# EAGLE design 3phasecntrl-rev2-1 (EAGLE 9.6.2)
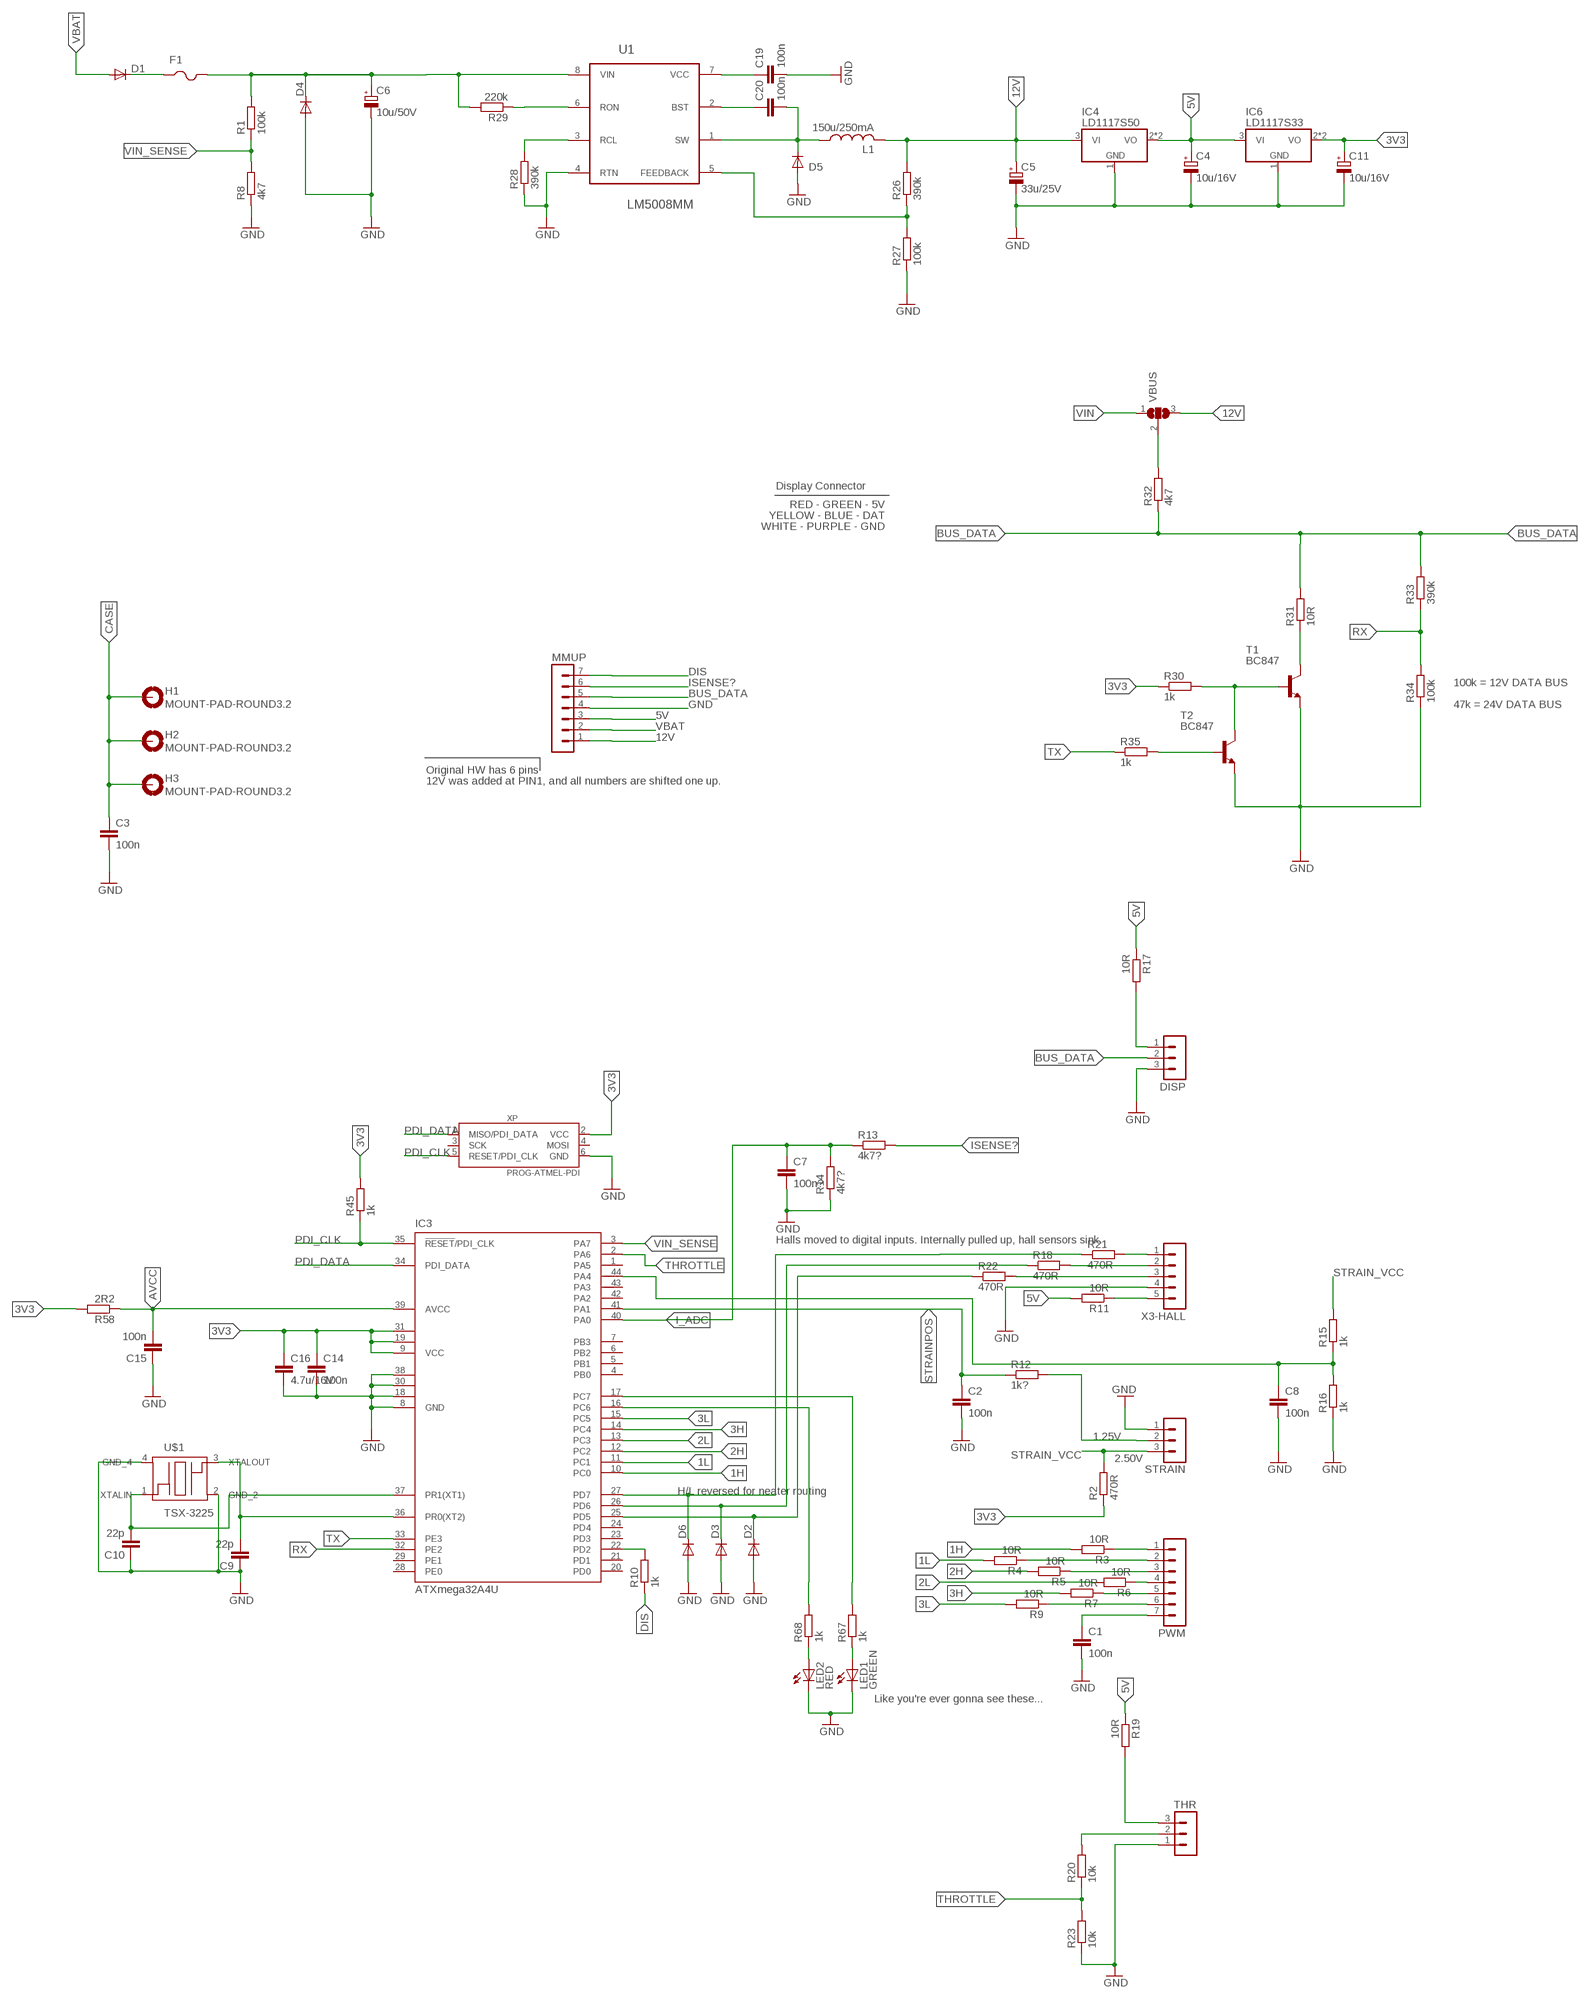
[diagram p0: schematic, sheet 1]

## Parts
C1  100n  C-EUC0805K  [C0805K]
C2  100n  C-EUC0805K  [C0805K]
C3  100n  C-EUC0805K  [C0805K]
C4  10u/16V  CPOL-EU153CLV-0405  [153CLV-0405]
C5  33u/25V  CPOL-EU153CLV-0605  [153CLV-0605]
C6  10u/50V  CPOL-EU153CLV-0605  [153CLV-0605]
C7  100n?  C-EUC0805K  [C0805K]
C8  100n  C-EUC0805K  [C0805K]
C9  22p  C-EUC0805K  [C0805K]
C10  22p  C-EUC0805K  [C0805K]
C11  10u/16V  CPOL-EU153CLV-0405  [153CLV-0405]
C14  100n  C-EUC0805K  [C0805K]
C15  100n  C-EUC0805K  [C0805K]
C16  4.7u/16V  C-EUC0805K  [C0805K]
C19  100n  C-EUC0805K  [C0805K]
C20  100n  C-EUC0805K  [C0805K]
D1  BAT46WH  DIODE-SMB  [SMB]
D2  PTVS3V3S1UTR  DIODE-SOD123  [SOD123]
D3  PTVS3V3S1UTR  DIODE-SOD123  [SOD123]
D4  SM6T39A  DIODE-SMB  [SMB]
D5  BAT46WH  DIODE-SOD323-W  [SOD323-W]
D6  PTVS3V3S1UTR  DIODE-SOD123  [SOD123]
DISP  MA03-1  [MA03-1]
F1  PTCFUSE-1812  [1812]
H1  MOUNT-PAD-ROUND3.2  [3,2-PAD]
H2  MOUNT-PAD-ROUND3.2  [3,2-PAD]
H3  MOUNT-PAD-ROUND3.2  [3,2-PAD]
IC3  ATXmega32A4U  XMEGA16A4A  [TQFP44]
IC4  LD1117S50  LM340ST-ST  [SOT223]
IC6  LD1117S33  LM340ST-ST  [SOT223]
L1  150u/250mA  L-USWE-TPC  [POWER-CHOKE_WE-TPC]
LED1  GREEN  LEDCHIPLED_0805  [CHIPLED_0805]
LED2  RED  LEDCHIPLED_0805  [CHIPLED_0805]
MMUP  MA07-1  [MA07-1]
PWM  MA07-1  [MA07-1]
R1  100k  R-EU_M0805  [M0805]
R2  470R  R-EU_M0805  [M0805]
R3  10R  R-EU_M0805  [M0805]
R4  10R  R-EU_M0805  [M0805]
R5  10R  R-EU_M0805  [M0805]
R6  10R  R-EU_M0805  [M0805]
R7  10R  R-EU_M0805  [M0805]
R8  4k7  R-EU_M0805  [M0805]
R9  10R  R-EU_M0805  [M0805]
R10  1k  R-EU_M0805  [M0805]
R11  10R  R-EU_M0805  [M0805]
R12  1k?  R-EU_M0805  [M0805]
R13  4k7?  R-EU_M0805  [M0805]
R14  4k7?  R-EU_M0805  [M0805]
R15  1k  R-EU_M0805  [M0805]
R16  1k  R-EU_M0805  [M0805]
R17  10R  R-EU_M0805  [M0805]
R18  470R  R-EU_M0805  [M0805]
R19  10R  R-EU_M0805  [M0805]
R20  10k  R-EU_M0805  [M0805]
R21  470R  R-EU_M0805  [M0805]
R22  470R  R-EU_M0805  [M0805]
R23  10k  R-EU_M0805  [M0805]
R26  390k  R-EU_M0805  [M0805]
R27  100k  R-EU_M0805  [M0805]
R28  390k  R-EU_M0805  [M0805]
R29  220k  R-EU_M0805  [M0805]
R30  1k  R-EU_M0805  [M0805]
R31  10R  R-EU_M0805  [M0805]
R32  4k7  R-EU_M0805  [M0805]
R33  390k  R-EU_M0805  [M0805]
R34  100k  R-EU_M0805  [M0805]
R35  1k  R-EU_M0805  [M0805]
R45  1k  R-EU_R0805  [R0805]
R58  2R2  R-EU_R0805  [R0805]
R67  1k  R-EU_M0805  [M0805]
R68  1k  R-EU_M0805  [M0805]
STRAIN  MA03-1  [MA03-1]
T1  BC847  [SOT23]
T2  BC847  [SOT23]
THR  MA03-1  [MA03-1]
U1  LM5008MM  [SOP65P490X109-8N]
U$1  TSX-3225  [TSX-3225]
VBUS  SJ2W  [SJ_2]
X3-HALL  MA05-1  [MA05-1]
XP  PROG-ATMEL-PDI  [6-LSTB2]

## Nets
1H: IC3.10(PC0) R3.2
1L: IC3.11(PC1) R4.2
2H: IC3.12(PC2) R5.2
2L: IC3.13(PC3) R6.2
3H: IC3.14(PC4) R7.2
3L: IC3.15(PC5) R9.2
3V3: C11.+ C14.1 C16.1 IC3.9(VCC) IC3.19(VCC1) IC3.31(VCC2) IC6.2(VO) IC6.4(VO) R2.1 R30.1 R45.2 R58.2 XP.2(VCC)
5V: C4.+ IC4.2(VO) IC4.4(VO) IC6.3(VI) MMUP.3 R11.2 R17.1 R19.1
12V: C5.+ IC4.3(VI) L1.2 MMUP.1 R26.2 VBUS.3
AVCC: C15.2 IC3.39(AVCC) R58.1
BUS_DATA: DISP.2 MMUP.5 R31.2 R32.1 R33.2
CASE: C3.1 H1.B3,2(MOUNT) H2.B3,2(MOUNT) H3.B3,2(MOUNT)
DIS: MMUP.7 R10.1
GND: C1.2 C2.2 C3.2 C4.- C5.- C6.- C7.2 C8.2 C9.1 C10.1 C11.- C14.2 C15.1 C16.2 C19.2 D2.A D3.A D4.A D5.A D6.A DISP.3 IC3.8(GND) IC3.18(GND1) IC3.30(GND2) IC3.38(GND3) IC4.1(GND) IC6.1(GND) LED1.C LED2.C MMUP.4 R8.1 R14.1 R16.1 R23.1 R27.1 R28.1 R34.1 STRAIN.1 T1.2(E) T2.2(E) THR.1 U1.4(RTN) U$1.2(GND_2) U$1.4(GND_4) X3-HALL.4 XP.6(GND)
I_ADC: C7.1 IC3.40(PA0) R13.1 R14.2
ISENSE?: MMUP.6 R13.2
N$1: C1.1 PWM.7
N$2: D1.C F1.1
N$3: C19.1 U1.7(VCC)
N$4: PWM.1 R3.1
N$5: R12.2 STRAIN.2
N$6: R32.2 VBUS.2
N$7: IC3.22(PD2) R10.2
N$8: R11.1 X3-HALL.5
N$9: R21.2 X3-HALL.1
N$10: PWM.2 R4.1
N$11: R18.2 X3-HALL.2
N$12: R31.1 T1.3(C)
N$13: R22.2 X3-HALL.3
N$14: C10.2 IC3.37(PR1(XT1)) U$1.1(XTALIN)
N$15: LED1.A R67.1
N$16: LED2.A R68.1
N$17: C20.1 U1.2(BST)
N$18: R19.2 THR.3
N$19: D6.C IC3.27(PD7) R21.1
N$20: IC3.16(PC6) R68.2
N$21: IC3.17(PC7) R67.2
N$22: C20.2 D5.C L1.1 U1.1(SW)
N$23: R35.2 T2.1(B)
N$24: R26.1 R27.2 U1.5(FEEDBACK)
N$25: R30.2 T1.1(B) T2.3(C)
N$26: D3.C IC3.26(PD6) R18.1
N$27: R28.2 U1.3(RCL)
N$28: PWM.3 R5.1
N$29: PWM.4 R6.1
N$30: R29.1 U1.6(RON)
N$31: D2.C IC3.25(PD5) R22.1
N$33: PWM.5 R7.1
N$34: PWM.6 R9.1
N$35: DISP.1 R17.2
N$44: C9.2 IC3.36(PR0(XT2)) U$1.3(XTALOUT)
PDI_CLK: IC3.35(!RESET!/PDI_CLK) R45.1 XP.5(RESET/PDI_CLK)
PDI_DATA: IC3.34(PDI_DATA) XP.1(MISO/PDI_DATA)
RX: IC3.32(PE2) R33.1 R34.2
STRAIN_VCC: R2.2 R15.2 STRAIN.3
STRAINPOS: C2.1 IC3.41(PA1) R12.1
STRAINREF: C8.1 IC3.44(PA4) R15.1 R16.2
THIN: R20.2 THR.2
THROTTLE: IC3.2(PA6) R20.1 R23.2
TX: IC3.33(PE3) R35.1
VBAT: D1.A MMUP.2
VIN: C6.+ D4.C F1.2 R1.2 R29.2 U1.8(VIN) VBUS.1
VIN_SENSE: IC3.3(PA7) R1.1 R8.2
Unconnected: IC3.1(PA5) IC3.4(PB0) IC3.5(PB1) IC3.6(PB2) IC3.7(PB3) IC3.20(PD0) IC3.21(PD1) IC3.23(PD3) IC3.24(PD4) IC3.28(PE0) IC3.29(PE1) IC3.42(PA2) IC3.43(PA3) XP.3(SCK) XP.4(MOSI)

## Notes on the sheet
- Display Connector
- RED - GREEN - 5V
- YELLOW - BLUE - DAT
- WHITE - PURPLE - GND
- 100k = 12V DATA BUS
- 47k = 24V DATA BUS
- Original HW has 6 pins
- 12V was added at PIN1, and all numbers are shifted one up.
- Halls moved to digital inputs. Internally pulled up, hall sensors sink.
- 1.25V
- 2.50V
- H/L reversed for neater routing
- Like you're ever gonna see these...

## Library data of the parts
C1-C3 C7-C10 C14-C16 C19 C20 = rcl:C-EU: CAPACITOR, European symbol
C4-C6 C11 = rcl:CPOL-EU: POLARIZED CAPACITOR, European symbol
D1 = diode:DIODE-: DIODE; FARNELL: 2069340
D2 D3 D6 = diode:DIODE-: DIODE; FARNELL: 2575110
D4 = diode:DIODE-: DIODE; FARNELL: 9802703
D5 = diode:DIODE-: DIODE
DISP STRAIN THR = con-lstb:MA03-1: PIN HEADER; OC_FARNELL: unknown; OC_NEWARK: unknown
F1 = adafruit:PTCFUSE: PTC fuses, resettable thermistors
H1-H3 = holes:MOUNT-PAD-ROUND: MOUNTING PAD, round
IC3 = atmel:XMEGA16A4: MICROCONTROLLER Features High-performance, Low-power 8/16-bit AVR XMEGA Microcontroller Non-Volatile Program and Data Memories - 16 KB - 128 KB of In-System Self-Programmable Flash - 4 KB - 8 KB Boot Code Section with Independent Lock Bits - 1 KB - 2 KB EEPROM - 2 KB - 8 KB Internal SRAM Peripheral Features - Four-channel DMA Controller with support for external requests - Eight-channel Event System - Five 16-bit Timer/Counters Three Timer/Counters with 4 Output Compare or Input Capture channels Two Timer/Counters with 2 Output Compare or Input Capture channels High-Resolution Extensions on all Timer/Counters Advanced Waveform Extension on one Timer/Counter - Five USARTs IrDA Extension on one USART - Two Two-Wire Interfaces with dual address match (I2C and SMBus compatible) - Two SPIs (Serial Peripheral Interfaces) peripherals - AES and DES Crypto Engine - 16-bit Real Time Counter with Separate Oscillator - One Twelve-channel, 12-bit, 2 Msps Analog to Digital Converter - One Two-channel, 12-bit, 1 Msps Digital to Analog Converter - Two Analog Comparators with Window compare function - External Interrupts on all General Purpose I/O pins - Programmable Watchdog Timer with Separate On-chip Ultra Low Power Oscillator Special Microcontroller Features - Power-on Reset and Programmable Brown-out Detection - Internal and External Clock Options with PLL - Programmable Multi-level Interrupt Controller - Sleep Modes: Idle, Power-down, Standby, Power-save, Extended Standby - Advanced Programming, Test and Debugging Interfaces PDI (Program and Debug Interface) for programming, test and debugging I/O and Packages - 34 Programmable I/O Lines - 44 - lead TQFP - 44 - pad VQFN/QFN - 49 - ball VFBGA Operating Voltage - 1.6 - 3.6V Speed performance - 0 - 12 MHz @ 1.6 - 3.6V - 0 - 32 MHz @ 2.7 - 3.6V Drawn by Dipl.-Ing. (FH) Robert Siegler Created: 27.05.09; OC_FARNELL: unknown; OC_NEWARK: unknown
IC4 = linear:LM340?-*: Positive VOLTAGE REGULATOR Source: http://cache.national.com/ds/LM/LM340.pdf; FARNELL: 1467780
IC6 = linear:LM340?-*: Positive VOLTAGE REGULATOR Source: http://cache.national.com/ds/LM/LM340.pdf
L1 = rcl:L-US: INDUCTOR, American symbol
LED1 LED2 = led:LED: LED OSRAM: - CHIPLED LG R971, LG N971, LY N971, LG Q971, LY Q971, LO R971, LY R971 LH N974, LH R974 LS Q976, LO Q976, LY Q976 LO Q996 - Hyper CHIPLED LW Q18S LB Q993, LB Q99A, LB R99A - SideLED LS A670, LO A670, LY A670, LG A670, LP A670 LB A673, LV A673, LT A673, LW A673 LH A674 LY A675 LS A676, LA A676, LO A676, LY A676, LW A676 LS A679, LY A679, LG A679 - Hyper Micro SIDELED® LS Y876, LA Y876, LO Y876, LY Y876 LT Y87S - SmartLED LW L88C, LW L88S LB L89C, LB L89S, LG L890 LS L89K, LO L89K, LY L89K LS L896, LA L896, LO L896, LY L896 - TOPLED LS T670, LO T670, LY T670, LG T670, LP T670 LSG T670, LSP T670, LSY T670, LOP T670, LYG T670 LG T671, LOG T671, LSG T671 LB T673, LV T673, LT T673, LW T673 LH T674 LS T676, LA T676, LO T676, LY T676, LB T676, LH T676, LSB T676, LW T676 LB T67C, LV T67C, LT T67C, LS T67K, LO T67K, LY T67K, LW E67C LS E67B, LA E67B, LO E67B, LY E67B, LB E67C, LV E67C, LT E67C LW T67C LS T679, LY T679, LG T679 LS T770, LO T770, LY T770, LG T770, LP T770 LB T773, LV T773, LT T773, LW T773 LH T774 LS E675, LA E675, LY E675, LS T675 LS T776, LA T776, LO T776, LY T776, LB T776 LHGB T686 LT T68C, LB T68C - Hyper Mini TOPLED® LB M676 - Mini TOPLED Santana® LG M470 LS M47K, LO M47K, LY M47K Source: http://www.osram.convergy.de LUXEON: - LUMILED® LXK2-PW12-R00, LXK2-PW12-S00, LXK2-PW14-U00, LXK2-PW14-V00 LXK2-PM12-R00, LXK2-PM12-S00, LXK2-PM14-U00 LXK2-PE12-Q00, LXK2-PE12-R00, LXK2-PE12-S00, LXK2-PE14-T00, LXK2-PE14-U00 LXK2-PB12-K00, LXK2-PB12-L00, LXK2-PB12-M00, LXK2-PB14-N00, LXK2-PB14-P00, LXK2-PB14-Q00 LXK2-PR12-L00, LXK2-PR12-M00, LXK2-PR14-Q00, LXK2-PR14-R00 LXK2-PD12-Q00, LXK2-PD12-R00, LXK2-PD12-S00 LXK2-PH12-R00, LXK2-PH12-S00 LXK2-PL12-P00, LXK2-PL12-Q00, LXK2-PL12-R00 Source: www.luxeon.com KINGBRIGHT: KA-3528ASYC Source: www.kingbright.com
MMUP PWM = con-lstb:MA07-1: PIN HEADER; OC_FARNELL: unknown; OC_NEWARK: unknown
R1-R23 R26-R35 R45 R58 R67 R68 = rcl:R-EU_: RESISTOR, European symbol
T1 T2 = transistor:BC847: NPN TRANSISTOR
U1 = components:LM5008MM: Step-Down Switching Regulator; MPN: LM5008MM; OC_FARNELL: 8181721; OC_NEWARK: 38K3760; PACKAGE: SOP-8; SUPPLIER: National Semiconductor
U$1 = crystals:TSX-3225
VBUS = jumper:SJ2W: SMD solder JUMPER
X3-HALL = con-lstb:MA05-1: PIN HEADER; OC_FARNELL: unknown; OC_NEWARK: unknown
XP = components:PROG-ATMEL-PDI

## Board
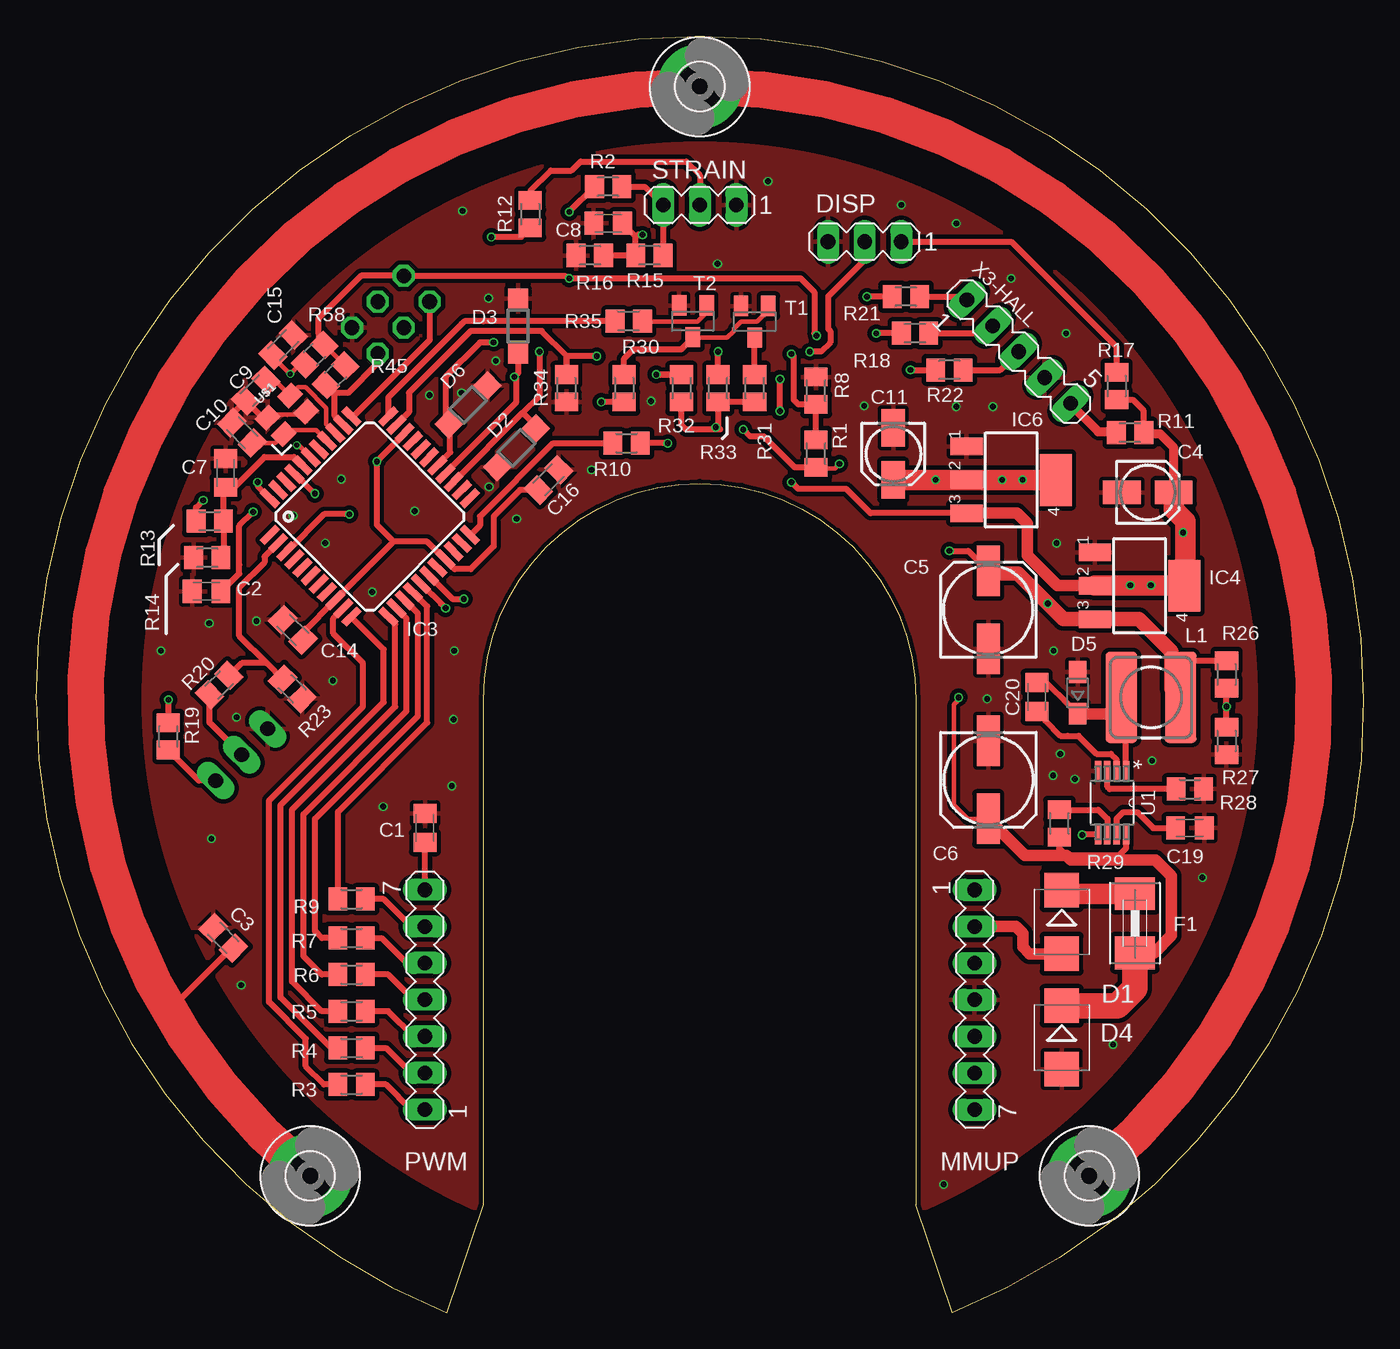
[diagram p1: board, top side]
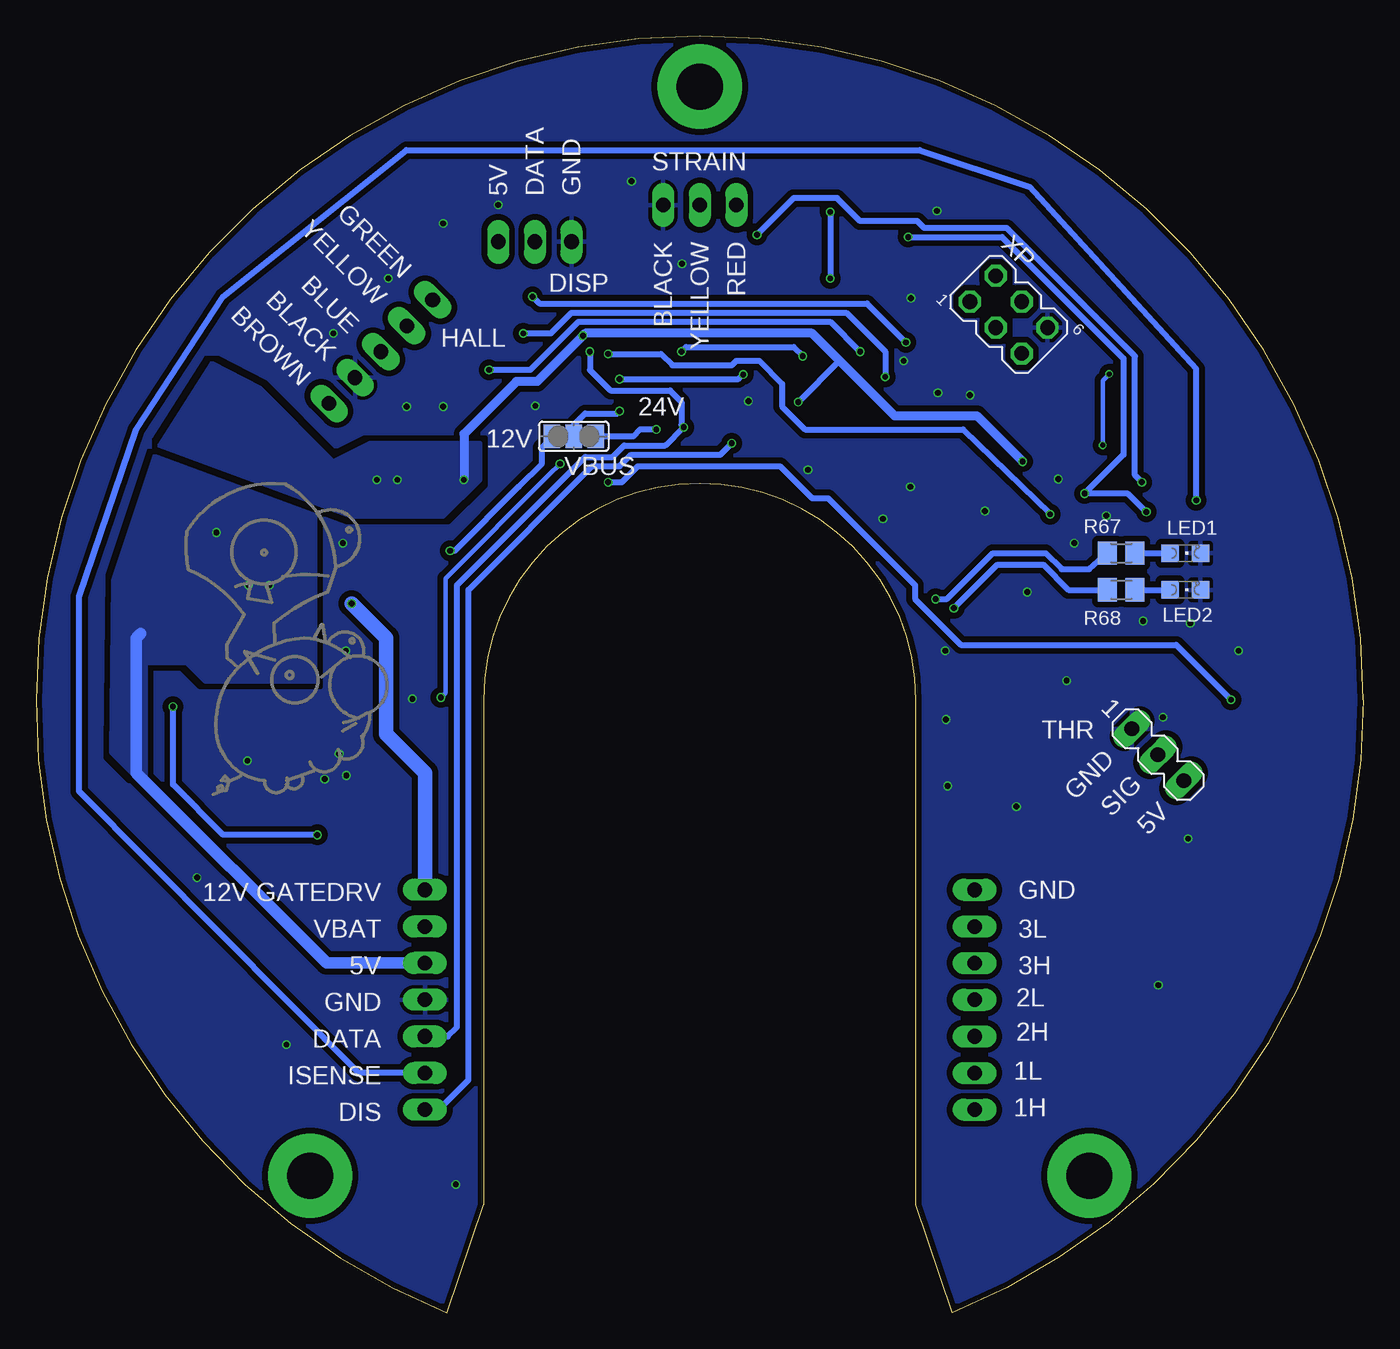
[diagram p2: board, bottom side, seen from below]

Size 92 x 88.5 mm. Coordinates in mm from the lower left corner, seen from the top.
Outline: 0,42.5 arc-90 46,88.5 arc-90 92,42.5 arc-68 63.5,0 61,7.5 61,42.5 arc180 31,42.5 31,7.5 28.5,0 arc-68 0,42.5
Copper layers (1*16): Top 0.035559375mm / dielectric 1.6mm / Bottom 0.035559375mm
Design rules "jlcpcb2layer": minimum track width 5mil, minimum drill 12mil, track to track 5mil, track to pad 5mil, pad to pad 5mil, via to via 5mil, smd to smd 5mil, copper to edge 8mil, drill to drill 6mil, minimum pad ring 5mil, minimum via ring 3mil, stop-mask expansion 2.5mil, vias tented up to drill 0mil, thermal gap 10mil
tRestrict: area 7,3.5 to 85,81.5

### Footprints (pad centres in the part's own frame; a part is rotated, then mirrored left to right if it is on the bottom)
C0805K = smd 1.3 x 1.6: 1 -1,0; 2 1,0
153CLV-0405 = smd 2.6 x 1.6: + 1.8,0; - -1.8,0
153CLV-0605 = smd 3.5 x 1.6: + 2.7,0; - -2.7,0
SMB = smd 2.4 x 2.4: A 2.2,0; C -2.2,0
SOD123 = smd 1.4 x 1.4: A 1.9,0; C -1.9,0
SOD323-W = smd 1.5 x 1.2: A 1.45,0; C -1.45,0
MA03-1 = drill 1.016 long: 1 -2.54,0; 2 0,0; 3 2.54,0
1812 = smd 2.286 x 2.794: 1 -2.046,0; 2 2.046,0
3,2-PAD = drill 3.2 pad 5.842: B3,2 0,0
TQFP44 = smd 1.5 x 0.5: 1 -5.8,4; 2 -5.8,3.2; 3 -5.8,2.4; 4 -5.8,1.6; 5 -5.8,0.8; 6 -5.8,0; 7 -5.8,-0.8; 8 -5.8,-1.6; 9 -5.8,-2.4; 10 -5.8,-3.2; 11 -5.8,-4; 23 5.8,-4; 24 5.8,-3.2; 25 5.8,-2.4; 26 5.8,-1.6; 27 5.8,-0.8; 28 5.8,0; 29 5.8,0.8; 30 5.8,1.6; 31 5.8,2.4; 32 5.8,3.2; 33 5.8,4 | smd 0.5 x 1.5: 12 -4,-5.8; 13 -3.2,-5.8; 14 -2.4,-5.8; 15 -1.6,-5.8; 16 -0.8,-5.8; 17 0,-5.8; 18 0.8,-5.8; 19 1.6,-5.8; 20 2.4,-5.8; 21 3.2,-5.8; 22 4,-5.8; 34 4,5.8; 35 3.2,5.8; 36 2.4,5.8; 37 1.6,5.8; 38 0.8,5.8; 39 0,5.8; 40 -0.8,5.8; 41 -1.6,5.8; 42 -2.4,5.8; 43 -3.2,5.8; 44 -4,5.8
SOT223 = smd 1.219 x 2.235: 1 -2.311,-3.099; 2 0,-3.099; 3 2.311,-3.099 | smd 3.6 x 2.2: 4 0,3.099
POWER-CHOKE_WE-TPC = smd 6.3 x 2.2: 1 0,2.05; 2 0,-2.05
CHIPLED_0805 = smd 1.2 x 1.2: A 0,-1.05; C 0,1.05
MA07-1 = drill 1.016 long: 1 -7.62,0; 2 -5.08,0; 3 -2.54,0; 4 0,0; 5 2.54,0; 6 5.08,0; 7 7.62,0
M0805 = smd 1.3 x 1.6: 1 -0.95,0; 2 0.95,0
R0805 = smd 1.3 x 1.5: 1 -0.95,0; 2 0.95,0
SOT23 = smd 1 x 1.4: 1 -0.95,-1.1; 2 0.95,-1.1; 3 0,1.1
SOP65P490X109-8N = smd 1.372 x 0.457: 1 -2.21,0.965; 2 -2.21,0.33; 3 -2.21,-0.33; 4 -2.21,-0.965; 5 2.21,-0.965; 6 2.21,-0.33; 7 2.21,0.33; 8 2.21,0.965
TSX-3225 = smd 1.4 x 1.15: 1 0,-1.6; 2 2.2,-1.6; 3 2.2,0; 4 0,0
SJ_2 = smd 1.168 x 1.6: 1 -1.524,0; 2 0,0; 3 1.524,0
MA05-1 = drill 1.016 long: 1 -5.08,0; 2 -2.54,0; 3 0,0; 4 2.54,0; 5 5.08,0
6-LSTB2 = drill 1.016 octagon: 1 -2.54,-1.27; 2 -2.54,1.27; 3 0,-1.27; 4 0,1.27; 5 2.54,-1.27; 6 2.54,1.27

### Placement (x,y rotation side)
C1  26.95,33.61 90 top
C2  11.81,50.02 180 top
C3  12.98,25.99 135 top
C4  77.06,56.88 0 top
C5  66,48.73 90 top
C6  66,36.94 270 top
C7  13.14,58.22 90 top
C8  39.65,75.52 180 top
C9  15.23,63.94 45 top
C10  14.28,61 315 top
C11  59.41,59.54 270 top
C14  17.8,47.34 135 top
C15  17.11,67.08 225 top
C16  35.52,57.74 45 top
C19  79.97,33.61 0 top
C20  69.36,42.69 90 top
D1  71.08,27.1 270 top
D2  33.3,59.96 225 top
D3  33.41,68.4 90 top
D4  71.08,19.09 270 top
D5  72.19,42.98 90 top
D6  29.94,62.94 45 top
DISP  57.43,74.25 180 top
F1  76.16,27.01 270 top
H1  19,9.5 0 top
H2  73,9.5 0 top
H3  46,85 0 top
IC3  23.14,55.2 45 top
IC4  76.48,50.4 270 top
IC6  67.59,57.74 270 top
L1  77.27,42.66 90 top
LED1  12.34,52.66 270 bottom
LED2  12.34,50.12 270 bottom
MMUP  65.05,21.7 270 top
PWM  26.95,21.7 90 top
R1  54.06,59.56 270 top
R2  39.65,78.06 0 top
R3  21.87,15.83 180 top
R4  21.87,18.37 180 top
R5  21.87,20.91 180 top
R6  21.87,23.45 180 top
R7  21.87,25.99 180 top
R8  54.06,63.92 270 top
R9  21.87,28.69 180 top
R10  40.92,60.28 180 top
R11  75.82,61.01 0 top
R12  34.25,76.16 90 top
R13  12.04,54.88 180 top
R14  11.87,52.34 0 top
R15  42.51,73.3 0 top
R16  38.38,73.3 0 top
R17  74.89,64.25 90 top
R18  60.92,67.9 0 top
R19  9.17,39.96 270 top
R20  12.69,43.52 225 top
R21  60.29,70.44 0 top
R22  63.3,65.36 0 top
R23  17.76,43.25 135 top
R26  82.51,44.25 90 top
R27  82.51,39.64 90 top
R28  79.97,36.31 180 top
R29  70.92,33.93 270 top
R30  40.76,64.09 90 top
R31  49.81,64.09 270 top
R32  44.73,64.09 90 top
R33  47.27,64.09 270 top
R34  36.76,64.09 90 top
R35  41.08,68.73 0 top
R45  20.76,65 45 top
R58  19.3,66.42 45 top
R67  16.79,52.66 180 bottom
R68  16.79,50.12 180 bottom
STRAIN  46,76.79 180 top
T1  49.81,68.69 180 top
T2  45.52,68.73 180 top
THR  14.25,38.69 315 bottom
U1  74.58,35.36 270 top
U$1  16.04,62.04 45 top
VBUS  54.73,60.76 180 bottom
X3-HALL  68.1,66.63 315 top
XP  24.59,69.19 315 bottom

### Tracks (layer width: path | path; a pad name or v marks a point on that pad's centre or on a via)
1H
  Top 0.406: R3.2 19.96,15.83 18.7,17.1 18.7,19 16.16,21.55 16.16,35.52 22.66,42.02 22.66,45.04 20.6,47.1 20.6,48.13 IC3.10
1L
  Top 0.406: R4.2 20.44,18.37 16.95,21.86 16.95,35.2 24.09,42.34 24.09,45.99 21.87,48.22 IC3.11
2H
  Top 0.406: R5.2 19.81,20.91 17.74,22.97 17.74,34.88 24.89,42.02 24.89,47.74 24.41,48.22 IC3.12
2L
  Top 0.406: R6.2 19.81,23.45 18.54,24.72 18.54,34.56 25.68,41.71 25.68,48.13 IC3.13
3H
  Top 0.406: R7.2 19.81,25.99 19.33,26.47 19.33,34.24 26.47,41.39 26.47,48.47 IC3.14
3L
  Top 0.406: R9.2 20.92,34.72 27.11,40.91 27.11,48.97 IC3.15
3V3  (via drill 0.4)
  Top 0.305: 19.56,67.88 19.56,67.51 R58.2 19.92,67.15 19.92,67.18 | 20,67.09 R45.2
  Top 0.406: R30.1 v39.18,63.14 v39.17,63.14 | IC3.19 28.33,52.23 | 28.33,52.23 27.11,53.45 24.79,53.45 | 24.79,53.45 IC3.9 18.51,47.17 C14.1 | IC3.31 25.54,60.94 v23.62,59.01 23.62,54.62 24.79,53.45 | R2.1 v36.95,76.31 | v54.1,67.74 53.94,67.9 53.94,70.76 52.98,71.71 v36.95,71.71 36.65,71.89 XP.2 22.52,71.89 19.56,68.92 19.56,67.88 | 28.33,52.23 29.01,51.55 30.12,51.55 31.71,53.14 31.71,55.2 33.55,57.03 C16.1 | R58.2 20,67.09 | 19.92,67.18 19.79,67.18
  Top 0.61: 59.65,57.74 59.81,57.58
  Top 0.813: IC6.4 70.13,57.74
  Top 1.422: 70.13,57.74 v68.38,57.74 v66.95,57.74 IC6.2 59.65,57.74 C11.+
  Bottom 0.406: v39.17,63.14 36.32,66 | v36.95,76.31 v36.95,71.71
  Bottom 0.61: v62.35,57.74 62.35,60.91 58.7,64.57 57.27,64.57 v54.1,67.74 53.94,67.9 38.22,67.9 36.32,66 32.51,62.19 26.79,62.19 v23.62,59.01
  pour Bottom (isolate 0.406, rank 2): 61.24,60.28 61.24,57.74 63.78,55.2 70.13,55.2 83.47,60.12 79.81,65.84 76.48,64.09 71.4,59.01 68.86,60.28
5V  (via drill 0.4)
  Top 0.406: R11.2 76.77,62.53 76,63.3 R17.1 | IC6.3 57.84,55.43 56.16,57.11 52.83,57.11 v52.35,57.58 | v9.17,42.5 R19.1
  Top 0.61: C4.+ 78.86,59.97 77.91,60.91 76.86,60.91 R11.2
  Top 0.813: IC6.3 68,55.43 68.7,54.72 68.7,52.5 70.8,50.4 IC4.2
  Top 1.016: IC4.4 77.31,50.4 v77.27,50.44
  Top 1.422: IC4.2 IC4.4 | IC4.4 79.62,50.4 79.66,50.44 | C4.+ 78.86,55.68 79.66,54.88 79.66,50.48 IC4.4
  Bottom 0.406: v52.35,57.58 51.4,57.58 50.29,58.69 40.44,58.69 38.22,56.47 37.11,56.47 31.08,50.44 31.08,49.48 27.9,46.31 12.98,46.31 v9.17,42.5
  Bottom 0.813: 84.73,47.1 85.05,46.79 85.05,37.42 71.88,24.24 MMUP.3
  other vias: 75.84,50.44 79.5,54.09
  pour Bottom (isolate 0.406, rank 3): 85.21,37.26 84.42,37.26 84.42,45.04 81.56,45.04 80.29,43.77 72.67,43.77 72.67,56.47 83.62,59.8 86.64,50.76 86.8,38.85
12V  (via drill 0.4)
  Top 0.406: R26.2 79.18,45.2 79.02,45.04 78.7,45.36 78.7,45.83 | v63.3,52.82 64.61,52.82 C5.+
  Top 1.016: L1.2 78.7,43.28 78.7,45.83 76.45,48.09 IC4.3 71.21,48.09 70.92,48.37 | 70.92,48.37 v70.13,49.17 | v70.13,49.17 69.18,50.12 68.07,51.23 66.2,51.23 C5.+ | v70.13,49.17 70.92,48.37
  Bottom 0.406: VBUS.3 56.16,60.76 56.95,59.96 56.95,58.85 58.54,57.26 62.99,52.82 v63.3,52.82
  Bottom 1.016: v70.13,49.17 67.75,46.79 67.75,40.12 65.05,37.42 MMUP.1
AVCC  (via drill 0.35)
  Top 0.305: IC3.39 18.2,60.14 v18.07,60.14 | R58.1 18.29,65.75 v17.62,65.08 16.41,66.29 C15.2
  Bottom 0.305: v18.07,60.14 18.07,64.63 v17.62,65.08
BUS_DATA  (via drill 0.4)
  Top 0.406: 44.73,62.82 44.73,61.55 45.05,61.23 47.43,61.23 47.27,61.39 | 47.27,61.39 R33.2 R31.2 | v47.11,61.39 47.27,61.39 | DISP.2 57.43,72.98 54.89,70.44 54.89,68.22 55.05,68.06 55.05,67.27 54.41,66.63 v53.62,66.63
  Top 0.61: 44.73,62.82 R32.1
  Bottom 0.406: MMUP.5 63.46,19.16 62.83,19.8 62.83,50.44 53.94,59.33 52.03,59.33 51.24,60.12 48.38,60.12 v47.11,61.39 47.27,61.55 R33.2 48.06,63.93 52.19,63.93 53.62,65.36 v53.62,66.63
CASE
  Top 0.406: H1.B3,2 18.08,9.5 18.06,9.48 | H1.B3,2 arc-140 H3.B3,2 | C3.1 13.54,25.28 9.17,20.91 9.17,19.33 H1.B3,2
  Top 2.54: H1.B3,2 arc-281 H2.B3,2
DIS  (via drill 0.4)
  Top 0.406: v43.78,60.28 R10.1
  Bottom 0.406: MMUP.7 64.1,14.08 62.19,15.99 62.03,16.15 62.03,50.12 53.46,58.69 51.56,58.69 50.76,59.49 44.57,59.49 v43.78,60.28
GND  (via drill 0.4)
  Top 0.305: U$1.4 16.27,62.27 18.53,62.27 U$1.2
  Top 0.406: IC3.18 27.79,51.66 | C10.1 13.57,62.28 C9.1 15.71,62.04 U$1.4
  other vias: 72,37 71,38.75 70.5,37.25 70.73,53.35 63.78,62.82 65.92,42.56 70.52,45.89 77.35,38.27 80.84,30.18 62.9,8.91 57.39,62.88 66.32,62.82 71.4,67.9 67.59,71.71 63.78,75.52 59.97,76.79 23.3,49.96 31.39,57.26 31.87,66 31.36,70.34 47.23,72.72 50.73,78.43 8.66,45.89 20.57,43.83 28.98,45.89 38.5,58.43 42.63,63.19 28.82,36.52 24.06,35.09 14.21,22.71 12.15,32.87 13.9,41.29 11.99,47.8 74.65,18.59 29.57,76.37 26.23,55.58 21.15,57.8 17.82,55.26 20.04,53.36 15.28,47.96 28.93,41.13 29.49,63.77 33.3,55.04 27.27,63.61
  pour Top (isolate 0.305, rank 6): -9,92.5 -9,-7.5 101,-7.5 101,91.5 101,92.5
  pour Bottom (isolate 0.406, rank 6): -7.73,91.23 -7.73,-8.77 102.27,-8.77 102.27,90.23 102.27,91.23
I_ADC
  Top 0.406: IC3.40 17.88,59.33 15.84,59.33 13.73,57.22 C7.1 12.99,57.07 R13.1 12.99,52.51 R14.2
ISENSE?  (via drill 0.4 pad 0.61)
  Top 0.406: R13.2 11.09,55.83 v11.58,56.33
  Bottom 0.406: MMUP.6 69.65,16.62 89.02,36.15 89.02,49.64 85.05,61.23 79.02,70.44 66.32,80.6 30.76,80.6 23.14,78.06 11.58,65.42 v11.58,56.33
N$1
  Top 0.406: PWM.7 26.95,32.34 C1.1
N$2
  Top 1.422: F1.1 71.35,29.06 | 71.35,29.06 71.08,29.32 | D1.C 71.11,29.3 71.35,29.06
N$3
  Top 0.406: U1.7 74.91,34.26 75.37,34.72 76.32,34.72 77.43,33.61 C19.1
N$4
  Top 0.406: PWM.1 26,14.08 24.25,15.83 22.98,15.83 R3.1
N$5
  Top 0.406: R12.2 34.25,77.74 35.68,79.17 37.11,79.17 37.74,79.81 45.05,79.81 46,78.85 STRAIN.2
N$6  (via drill 0.4)
  Top 0.406: v51.56,62.5 v51.56,64.72 | R32.2 v42.99,65.04 v42.98,65.04 R32.2
  Bottom 0.406: VBUS.2 54.73,61.55 53.94,62.34 51.72,62.34 v51.56,62.5 | v51.56,64.72 43.3,64.72 v42.98,65.04
N$7
  Top 0.305: IC3.22 30.12,53.93
  Top 0.406: R10.2 35.84,60.28 30.76,55.2 30.76,54.56 30.12,53.93
N$8
  Top 0.61: X3-HALL.5 71.69,63 73.62,61.07 74.73,61.07 74.89,60.91
  Top 0.813: 74.89,60.91 74.89,60.99 R11.1
N$9
  Top 0.406: R21.2 64.29,70.44 X3-HALL.1
N$10
  Top 0.406: R4.1 24.25,18.37 26,16.62 PWM.2
N$11
  Top 0.406: R18.2 65.79,67.9 X3-HALL.2
N$12
  Top 0.406: R31.1 T1.3
N$13
  Top 0.406: R22.2 66.84,65.36 X3-HALL.3
N$14
  Top 0.305: IC3.37 19.41,61.19 17.45,61.19 U$1.1 16.56,60.29 C10.2
N$15
  Bottom 0.406: R67.1 LED1.A
N$16
  Bottom 0.406: R68.1 LED2.A
N$17
  Top 0.406: C20.1 69.94,41.05 71,40 71.5,40 72.25,40 73.5,38.75 74.5,38.75 74.91,38.34 U1.2
N$18
  Top 0.406: THR.3 11.29,36.89 R19.2
N$19  (via drill 0.4)
  Top 0.406: R21.1 v57.59,70.44 | 27.74,58.69 27.76,58.69 IC3.27 27.81,58.76 28.7,59.64 28.7,61.5 D6.C 28.38,61.81 28.38,64.88 30.76,67.27 v31.71,67.27
  Bottom 0.406: v57.59,70.44 57.11,69.96 34.41,69.96 v31.71,67.27
N$20  (via drill 0.4)
  Top 0.406: 26.7,50.53 IC3.16 26.7,50.53 | 26.7,50.53 28.06,49.17 v28.38,48.85 26.7,50.53
  Bottom 0.406: v28.38,48.85 25.36,51.87 22.19,51.87 20.44,50.12 R68.2
N$21  (via drill 0.4)
  Top 0.406: IC3.17 28.86,49.48 v29.65,49.48
  Bottom 0.406: v29.65,49.48 28.86,49.48 25.68,52.66 22.03,52.66 20.92,51.55 19.01,51.55 R67.2
N$22
  Top 0.406: C20.2 69.99,43.69 70.3,43.38 71.25,42.47 D5.C | U1.1 75.54,41.23 75.54,42.34 L1.1
  Top 0.813: D5.C 74.91,41.53 75.21,41.23 75.54,41.23
N$23
  Top 0.305: T2.1 46.47,69.33 45.84,68.69 42.07,68.69 R35.2
N$24  (via drill 0.4)
  Top 0.406: R27.2 v82.51,42.02 | v82.51,42.02 82.51,42.18 | 82.51,42.18 R26.1 | U1.5 72.52,33.15 v72.51,33.13 | v82.51,42.02 82.51,42.18
  Bottom 0.406: v72.51,33.13 79.02,33.13 82.51,36.63 v82.51,42.02
N$25
  Top 0.305: T1.1 50.76,69.48 49.97,68.69 48.86,68.69 48.38,68.22 48.38,68.06 47.91,67.58 45.57,67.58 T2.3
  Top 0.406: R30.2 40.76,66.15 41.4,66.79 44.73,66.79 45.52,67.58 T2.3
N$26  (via drill 0.4)
  Top 0.406: R18.1 v58.22,67.9 | IC3.26 28.37,58.21 28.38,58.22 33.3,63.14 33.3,64.72 v33.14,64.88 33.41,65.16 D3.C
  Bottom 0.406: v58.22,67.9 56.32,67.9 54.89,69.33 35.84,69.33 33.14,66.63 v33.14,64.88
N$27
  Top 0.406: R28.2 74.42,36.31 74.26,36.47 74.26,37.55 U1.3
N$28
  Top 0.406: PWM.3 26.16,19.16 24.41,20.91 R5.1
N$29
  Top 0.406: PWM.4 26.16,21.7 24.41,23.45 R6.1
N$30
  Top 0.406: R29.1 73.62,34.88 74.26,34.24 74.26,33.16 U1.6
N$31  (via drill 0.4)
  Top 0.406: v60.61,65.36 62.19,65.36 62.35,65.2 R22.1 | v34.89,66.63 34.89,63.55 33.73,62.39 | 33.73,62.39 IC3.25 | D2.C 34.64,61.48 33.73,62.39
  Bottom 0.406: v60.61,65.36 57.75,65.36 54.41,68.69 36.95,68.69 v34.89,66.63
N$33
  Top 0.406: R7.1 23.93,25.99 25.68,24.24 PWM.5
N$34
  Top 0.406: PWM.6 26,26.78 24.09,28.69 R9.1
N$35
  Top 0.406: R17.2 74.89,66.95 67.59,74.25 DISP.1
N$44
  Top 0.305: IC3.36 20.12,61.61 20.12,62.71 18.67,64.16 18.16,64.16 U$1.3 16.55,64.64 C9.2
PDI_CLK
  Top 0.406: XP.5 23.69,65.83 21.62,63.76 20.71,63.76 | R45.1 19.72,64.32 19.57,64.17 19.98,63.76 20.71,63.76 | IC3.35 20.71,62.16 20.71,63.76
PDI_DATA
  Top 0.406: IC3.34 21.97,62.13 27.11,67.27 27.28,67.44 XP.1
RX  (via drill 0.4)
  Top 0.406: R33.1 v47.27,66.63 | v38.86,66.31 36.75,66.31 R34.2 36.76,66.35 35.05,68.06 31.47,68.06 30.12,68.06 25.84,63.77 25.84,62.42 IC3.32
  Bottom 0.406: v47.27,66.63 46.95,66.95 39.49,66.95 v38.86,66.31
STRAIN_VCC
  Top 0.406: R2.2 42.19,78.06 STRAIN.3 R15.2
STRAINPOS  (via drill 0.4)
  Top 0.406: R12.1 33.62,74.57 v31.55,74.57 | C2.1 14.08,51.24 14.09,51.87 14.09,54.56 v15.04,55.52 | v19.33,56.79 19.29,56.79 IC3.41
  Bottom 0.406: v31.55,74.57 25.05,74.57 16.63,66.15 16.63,59.49 v19.33,56.79 16.31,56.79 v15.04,55.52
STRAINREF  (via drill 0.4)
  Top 0.406: 41.56,74.61 R15.1 R16.2 | 41.56,74.61 C8.1 | IC3.44 15.36,57.32 v15.36,57.58 | v42.03,74.73 41.67,74.73 41.56,74.61
  Bottom 0.406: v15.36,57.58 15.84,58.06 15.84,66.31 24.73,75.2 30.44,75.2 30.92,75.68 34.89,75.68 36.48,77.27 39.49,77.27 v42.03,74.73
THIN
  Top 0.406: THR.2 12.02,40.92 R20.2
THROTTLE
  Top 0.406: R23.2 15.97,45.04 | 15.97,45.04 14.25,45.04 13.4,44.19 R20.1 | IC3.2 15.84,52.42 15.84,52.02 14.09,50.28 14.09,46.92 15.97,45.04
TX
  Top 0.406: R35.1 31.01,68.73 29.69,68.73 29.49,68.53 24.41,63.46 IC3.33
VBAT
  Top 0.813: D1.A 71.06,24.88 68.86,24.88 68.38,25.36 68.38,26.31 67.91,26.78 MMUP.2
VIN  (via drill 0.4)
  Top 0.305: C6.+ 64.58,34.24 63.62,35.2 63.62,42.18 63.94,42.5 v63.94,42.66 | v55.68,58.85 55.37,58.53 54.41,58.53
  Top 0.406: U1.8 75.54,32.19 75.05,31.7 | 75.05,31.7 71.4,31.7 | 71.4,31.7 71.24,31.7 | 71.24,31.7 71.4,31.7 | 71.4,31.7 70.92,32.18 R29.2 | 75.05,31.7 71.4,31.7 | 71.4,31.7 71.24,31.7 | 71.24,31.7 71.4,31.7 | R1.2 52.59,58.61 50.45,60.76 49.49,60.76 v49.02,61.23
  Top 0.61: R1.2 54.34,58.61 54.41,58.53
  Top 0.813: C6.+ 68.54,31.7 71.24,31.7 71.4,31.7 71.72,31.39 77.59,31.39 78.7,30.28 78.7,26.15 77.52,24.97 F1.2
  Top 1.422: 76.16,24.24 F1.2
  Top 1.778: D4.C 74.95,21.29 76.16,22.5 76.16,24.24
  Bottom 0.305: v63.94,42.66 63.62,42.98 63.62,50.91 56.48,58.06 v55.68,58.85
  Bottom 0.406: v49.02,61.23 50.13,61.23 50.6,60.76 VBUS.1
VIN_SENSE  (via drill 0.4)
  Top 0.305: IC3.3 17.36,52.82 17.43,52.82
  Top 0.406: 54.1,62.82 54.06,62.78 R1.1 R8.2 52.83,62.97 52.51,63.3 52.51,66.31 v52.35,66.47 | v21.71,55.36 19.96,55.36 17.43,52.82
  Bottom 0.406: v52.35,66.47 48.7,66.47 47.91,65.68 43.78,65.68 43.46,66 41.87,66 40.28,64.41 40.28,62.82 38.7,61.23 27.74,61.23 v21.71,55.36

### Text on the board
bPlace: STRAIN | GND | DATA | 5V | RED | YELLOW | BLACK | GREEN | DISP | YELLOW | BLUE | HALL | BLACK | BROWN | 24V | 12V | GND | SIG | 5V | 12V GATEDRV | GND | VBAT | 3L | 5V | 3H | GND | 2L | DATA | 2H | ISENSE | 1L | DIS | 1H
Measures: INNER DIMENSION | OUTER DIMENSION | COPPER FILL
Document: DNC / 12V | Purple | Brown | Blue | Red | Green | Orange | Yellow | Yellow | Orange | Green | Red | Blue | Brown
tDocu: D. Prins / T Ligeon | Jun 2020 | REV2.1